# Altium schematic sheet Sheet1.SchDoc
size A3; SheetNumber: 1; SheetTotal: 2
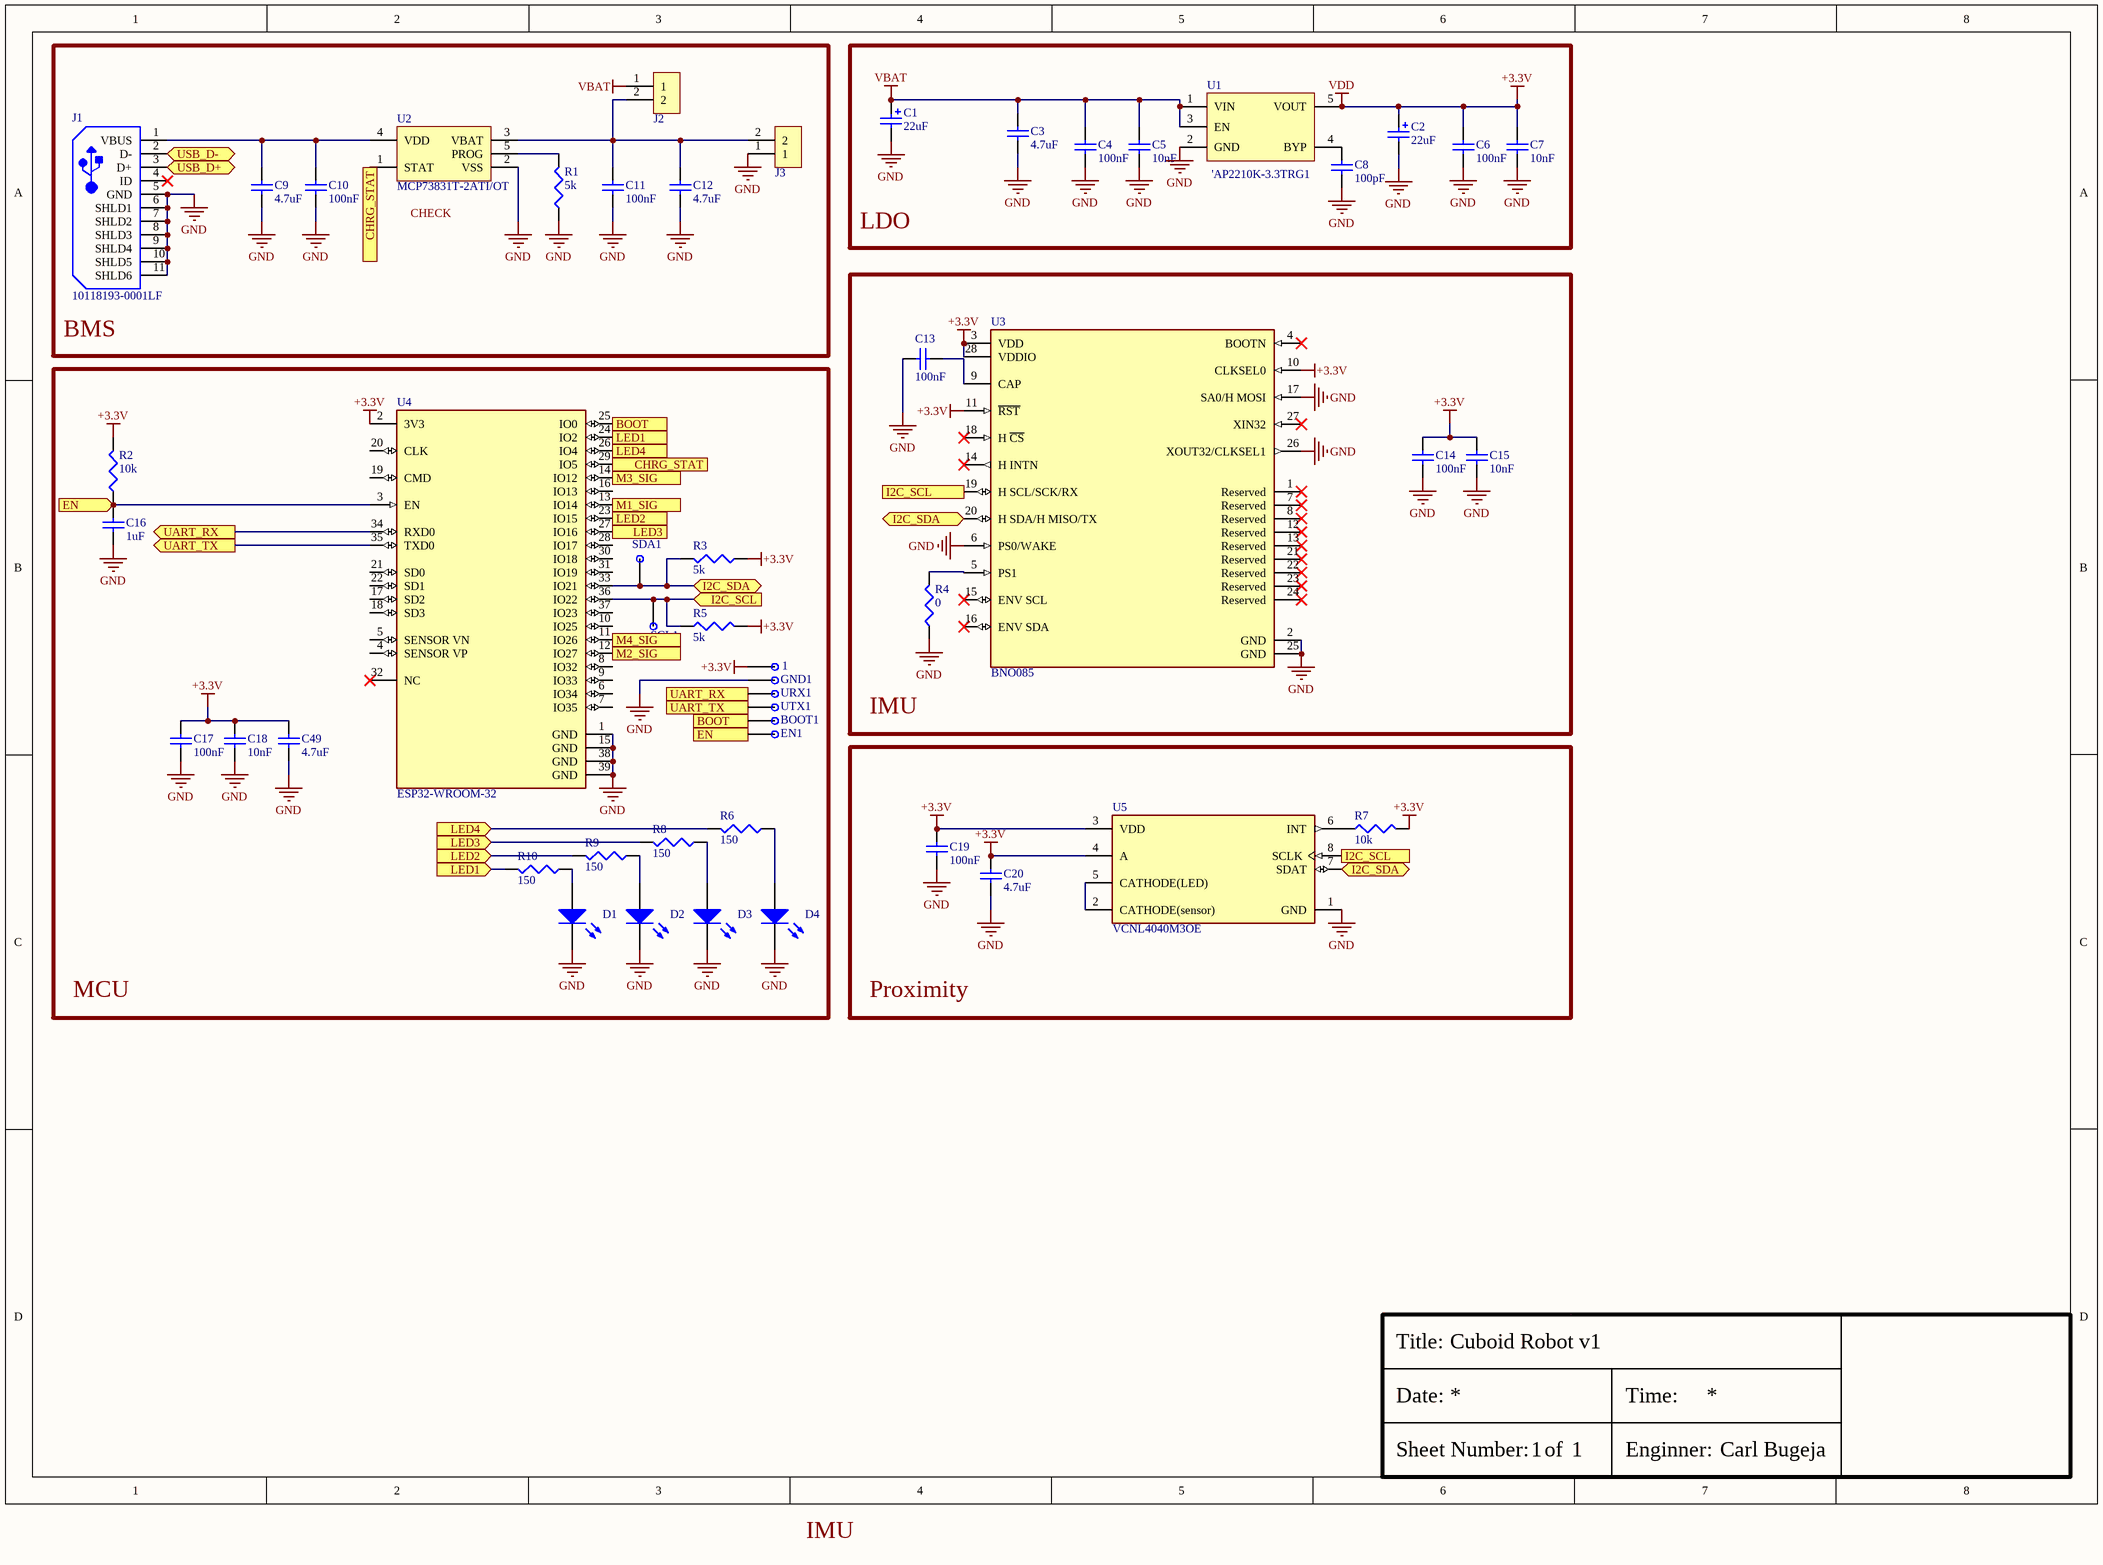
[diagram p0: Sheet1.SchDoc]

## Parts
1  TESTPAD  [TESTPAD]  (value not drawn)
BOOT1  TESTPAD  [TESTPAD]  (value not drawn)
C1  22uF  [CAPAE4343X55M]
C2  22uF  [CAPAE4343X55M]
C3  4.7uF  [RESC1005X03N]
C4  100nF  [RESC1005X03N]
C5  10nF  [RESC1005X03N]
C6  100nF  [RESC1005X03N]
C7  10nF  [RESC1005X03N]
C8  100pF  [RESC1005X03N]
C9  4.7uF  [RESC1005X03N]
C10  100nF  [RESC1005X03N]
C11  100nF  [RESC1005X03N]
C12  4.7uF  [RESC1005X03N]
C13  100nF  [RESC1005X03N]
C14  100nF  [RESC1005X03N]
C15  10nF  [RESC1005X03N]
C16  1uF  [RESC1005X03N]
C17  100nF  [RESC1005X03N]
C18  10nF  [RESC1005X03N]
C19  100nF  [RESC1005X03N]
C20  4.7uF  [RESC1005X03N]
C49  4.7uF  [RESC1005X03N]
D1  156120VS75000  [1206  RECTANGULAR-REVERSE USE]  (value not drawn)
D2  156120VS75000  [1206  RECTANGULAR-REVERSE USE]  (value not drawn)
D3  156120VS75000  [1206  RECTANGULAR-REVERSE USE]  (value not drawn)
D4  156120VS75000  [1206  RECTANGULAR-REVERSE USE]  (value not drawn)
EN1  TESTPAD  [TESTPAD]  (value not drawn)
GND1  TESTPAD  [TESTPAD]  (value not drawn)
J1  10118193-0001LF  [FCI-10118193-0001LF-5_V]
J2  H2P2.54  [M20-8890245R]  (value not drawn)
J3  H2P2.54  [T2P2.54]  (value not drawn)
R1  5k  [RESC1005X03N]
R2  10k  [RESC1005X03N]
R3  5k  [RESC1005X03N]
R4  0  [RESC1005X03N]
R5  5k  [RESC1005X03N]
R6  150  [RESC1005X03N]
R7  10k  [RESC1005X03N]
R8  150  [RESC1005X03N]
R9  150  [RESC1005X03N]
R10  150  [RESC1005X03N]
SCL1  TESTPAD  [TESTPAD]  (value not drawn)
SDA1  TESTPAD  [TESTPAD]  (value not drawn)
U1  'AP2210K-3.3TRG1  [SOT95P282X145-5N]
U2  MCP73831T-2ATI/OT  [SOT95P270X145-5N]
U3  BNO085  [FP-BNO085-MFG]
U4  ESP32-WROOM-32  [FP-ESP32-WROOM-32-MFG]
U5  VCNL4040M3OE  [FP-VCNL4040M3OE-MFG]
URX1  TESTPAD  [TESTPAD]  (value not drawn)
UTX1  TESTPAD  [TESTPAD]  (value not drawn)

## Blocks framed on the sheet
BMS: C9-C12 J1-J3 R1 U2
LDO: C1-C8 U1
IMU: C13-C15 R4 U3
MCU: 1 BOOT1 C16-C18 C49 D1-D4 EN1 GND1 R2 R3 R5 R6 R8-R10 SCL1 SDA1 U4 URX1 UTX1
Proximity: C19 C20 R7 U5

## Ports
BOOT (in), BOOT (out), CHRG_STAT (in), EN (in), I2C_SCL (in), I2C_SDA (bidir), LED1 (in), LED1 (out), LED2 (in), LED2 (out), LED3 (in), LED3 (out), LED4 (in), LED4 (out), M1_SIG (out), M2_SIG (out), M3_SIG (out), M4_SIG (out), UART_RX (in), UART_RX (out), UART_TX (in), UART_TX (out), USB_D+ (bidir), USB_D- (bidir)

## Nets
+3.3V: 1.1 C2.1 C6.1 C7.1 C14.1 C15.1 C17.1 C18.1 C19.1 C20.1 C49.1 R2.2 R3.1 R5.2 R7.2 U1.5(VOUT) U3.3(VDD) U3.10(CLKSEL0) U3.11(~{RST}) U3.28(VDDIO) U4.2(3V3) U5.3(VDD) U5.4(A)  [also labelled VDD]
GND: C1.2 C2.2 C3.2 C4.2 C5.2 C6.2 C7.2 C8.2 C9.2 C10.2 C11.2 C12.2 C13.1 C14.2 C15.2 C16.2 C17.2 C18.2 C19.2 C20.2 C49.2 D1.1(K) D2.1(K) D3.1(K) D4.1(K) GND1.1 J1.5(GND) J1.6(SHLD1) J1.7(SHLD2) J1.8(SHLD3) J1.9(SHLD4) J1.10(SHLD5) J1.11(SHLD6) J3.1 R1.1 R4.1 U1.2(GND) U2.2(VSS) U3.2(GND) U3.6(PS0/WAKE) U3.17(SA0/H_MOSI) U3.25(GND) U3.26(XOUT32/CLKSEL1) U4.1(GND) U4.15(GND) U4.38(GND) U4.39(GND) U5.1(GND)
VBAT: C1.1 C3.1 C4.1 C5.1 J2.1 U1.1(VIN) U1.3(EN)
BOOT: BOOT1.1 U4.25(IO0) ; port BOOT
CHRG_STAT: U2.1(STAT) U4.29(IO5) ; port CHRG_STAT
EN: C16.1 EN1.1 R2.1 U4.3(EN) ; port EN
I2C_SCL: R5.1 SCL1.1 U3.19(H_SCL/SCK/RX) U4.36(IO22) U5.8(SCLK) ; port I2C_SCL
I2C_SDA: R3.2 SDA1.1 U3.20(H_SDA/H_MISO/TX) U4.33(IO21) U5.7(SDAT) ; port I2C_SDA
LED1: R10.2 U4.24(IO2) ; port LED1
LED2: R9.2 U4.23(IO15) ; port LED2
LED3: R8.2 U4.27(IO16) ; port LED3
LED4: R6.2 U4.26(IO4) ; port LED4
M1_SIG: U4.13(IO14) ; port M1_SIG
M2_SIG: U4.12(IO27) ; port M2_SIG
M3_SIG: U4.14(IO12) ; port M3_SIG
M4_SIG: U4.11(IO26) ; port M4_SIG
UART_RX: U4.34(RXD0) URX1.1 ; port UART_RX
UART_TX: U4.35(TXD0) UTX1.1 ; port UART_TX
USB_D+: J1.3(D+) ; port USB_D+
USB_D-: J1.2(D-) ; port USB_D-
NetC8_1: C8.1 U1.4(BYP)
NetC9_1: C9.1 C10.1 J1.1(VBUS) U2.4(VDD)
NetC11_1: C11.1 C12.1 J2.2 J3.2 U2.3(VBAT)
NetC13_2: C13.2 U3.9(CAP)
NetD1_2: D1.2(A) R10.1
NetD2_2: D2.2(A) R9.1
NetD3_2: D3.2(A) R8.1
NetD4_2: D4.2(A) R6.1
NetR1_2: R1.2 U2.5(PROG)
NetR4_2: R4.2 U3.5(PS1)
NetR7_1: R7.1 U5.6(INT)
NetU5_2: U5.2(CATHODE(sensor)) U5.5(CATHODE(LED))

Not connected (* = marked no-connect by the designer): J1 4(ID)*; U3 1(Reserved)* 4(BOOTN)* 7(Reserved)* 8(Reserved)* 12(Reserved)* 13(Reserved)* 14(H_INTN)* 15(ENV_SCL)* 16(ENV_SDA)* 18(H_~{CS})* 21(Reserved)* 22(Reserved)* 23(Reserved)* 24(Reserved)* 27(XIN32)*; U4 4(SENSOR_VP) 5(SENSOR_VN) 6(IO34) 7(IO35) 8(IO32) 9(IO33) 10(IO25) 16(IO13) 17(SD2) 18(SD3) 19(CMD) 20(CLK) 21(SD0) 22(SD1) 28(IO17) 30(IO18) 31(IO19) 32(NC)* 37(IO23)

## Notes on the sheet
- (near U2) CHECK
- IMU
- Title:
- Cuboid Robot v1
- Date:
- Sheet Number:
- 1
- of
- Enginner:
- Time:
- Carl Bugeja

## Library data of the parts
C1 C2 = CAP*
C3-C20 C49 = CAP
D1-D4 = CMP-1428-00009-1: SMD mono-color reverse mount waterclear Chip LED, WL-SMRW, Bright Green; Manufacturer: Wuerth Elektronik; Lens Type: Rectangular; ComponentLink1Description: Manufacturer URL; Color: Bright Green; ComponentLink2Description: Datasheet; PackageReference: 1206  RECTANGULAR-REVERSE USE; ComponentLink1URL: http://www.we-online.com; ComponentLink2URL: http://katalog.we-online.com/led/datasheet/156120VS75000.pdf; PartNumber: 156120VS75000
J1 = CMP-2000-05119-1: Micro USB B Type Receptacle, -55 to 85 degC, 5-Pin SMD, RoHS, Tape and Reel; Manufacturer: FCI; Insulation Resistance: 1000MOhms; Gender: Female; Current Rating: 1.8A; Number of Contacts: 5Contact; Connector Type: MicroUSBTypeBreceptacle; Mounting Angle: Right; Datasheet Version: Rev. C, 05/2015; Packaging: Reel; Product Category: USBConnectors; Standard: USB2.0; Factory Pack Quantity: 1200; Operating Temperature Range: -55Cto+85C; Termination Style: SMD/SMT; Datasheet URL: http://datasheet.octopart.com/10118193-0001LF-FCI-datasheet-55953155.pdf; Contact Material: CopperAlloy; RoHS: Details; Contact Plating: Gold; Flammability Rating: UL94V-0; Manufacturer URL: http://www.fci.com/; Brand: FCI; Product: MicroUSBTypeBConnectors; Color: Black
R1-R10 = RES
U1 = AP2210K-3.0TRG1
U3 = CMP-197298-000001-1: IMU ACCEL/GYRO/MAG I2C 32BIT; Manufacturer: Hillcrest Laboratories, Inc.; Sensor Type: Accelerometer,Gyroscope,Magnetometer; Max Supply Voltage: 3.6V; Sensor Output: I2C,SPI,UART; Accel Range: 8g; Min Supply Voltage: 1.7V; Temperature Range High: +85°C; ComponentLink2URL: https://www.hillcrestlabs.com/download/5a747b8d566d073a5d000536; Octopart: https://octopart.com/bno085-hillcrest+laboratories-92813482; Height: 1.18mm; Device Class L1: Sensors; Digikey Description: IMU ACCEL/GYRO/MAG I2C 32BIT; Automotive: No; Package: BNO085; Device Class L3: Inertial Measurement Units (IMUs); Temperature: -40°C to +85°C; Category: IC; Device Class L2: Motion Sensors; Lead Free: Yes; Manufacturer Part Number: BNO085; Temperature Range Low: -40°C; RoHS: TRUE; ComponentLink2Description: Datasheet
U4 = CMP-194065-000008-1: RX TXRX MOD WIFI SURFACE MOUNT; Frequency: 2.5GHz; Sensitivity: -98dBm; Operating Supply Voltage: 3.6V; Data Rate: 150Mbps; Weight: 0.088185oz; Package Quantity: 550; Min Operating Temperature: -40°C; Mount: Surface Mount; Max Operating Temperature: 85°C; Packaging: Cut Tape; Case/Package: SMD/SMT
U5 = CMP-02530-000002-1: SENSOR OPT 550NM AMBIENT 8SMD; Manufacturer: Vishay; Sensor Output: I2C; Max Supply Voltage: 3.6V; Min Supply Voltage: 2.5V; Operating Supply Current: 0.2-300uA; ComponentLink2Description: Datasheet; Temperature: -40°C to +85°C; Device Class L2: Optical Sensors; Digikey Description: SENSOR OPT 550NM AMBIENT 8SMD; Package: 0; ComponentLink2URL: https://www.vishay.com/docs/84274/vcnl4040.pdf; Device Class L3: unset; Temperature Range High: +85°C; Height: 1.15mm; Ambient Temperature Range High: +85°C; Lead Free: Yes; Ambient Temperature Range Low: -40°C; Automotive: No; RoHS: TRUE; Category: IC; Device Class L1: Sensors; Temperature Range Low: -40°C; Octopart: https://octopart.com/vcnl4040m3oe-vishay-56243155; Manufacturer Part Number: VCNL4040M3OE